# EAGLE design fastkey - v1 (EAGLE 9.1.3)
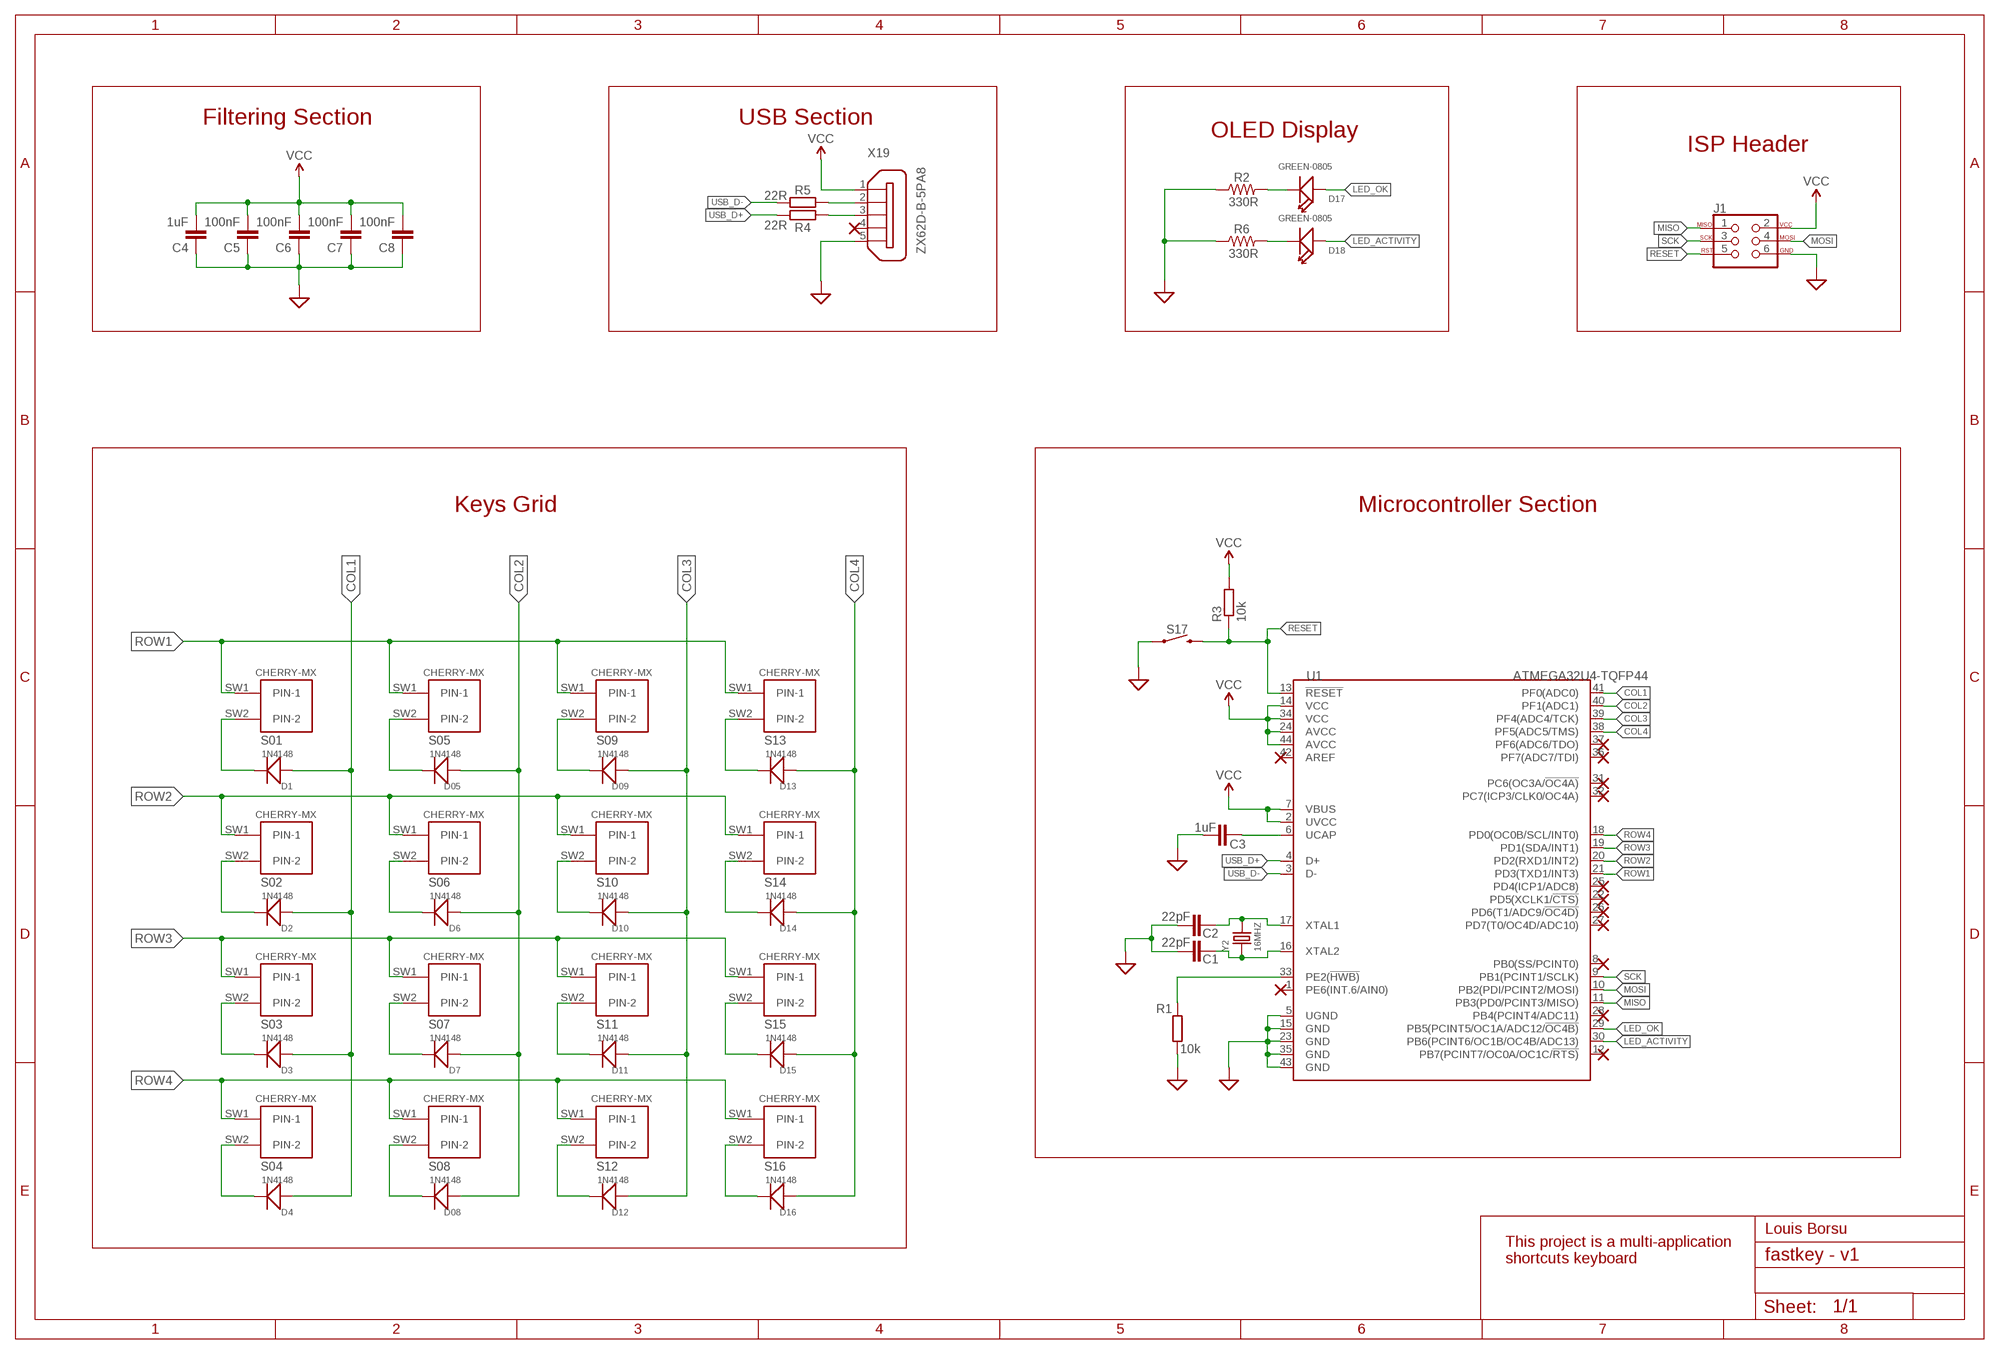
[diagram p0: schematic, sheet 1]

## Parts
C1  22pF  CAPACITOR_0805_M  [RESC0805_M]
C2  22pF  CAPACITOR_0805_M  [RESC0805_M]
C3  1uF  CAPACITOR_0805_M  [RESC0805_M]
C4  1uF  CAPACITOR_0805_M  [RESC0805_M]
C5  100nF  CAPACITOR_0805_M  [RESC0805_M]
C6  100nF  CAPACITOR_0805_M  [RESC0805_M]
C7  100nF  CAPACITOR_0805_M  [RESC0805_M]
C8  100nF  CAPACITOR_0805_M  [RESC0805_M]
D1  1N4148  SMD-DIODE-SWITCH-1N4148(LL-34)  [LL-34]
D2  1N4148  SMD-DIODE-SWITCH-1N4148(LL-34)  [LL-34]
D3  1N4148  SMD-DIODE-SWITCH-1N4148(LL-34)  [LL-34]
D4  1N4148  SMD-DIODE-SWITCH-1N4148(LL-34)  [LL-34]
D05  1N4148  SMD-DIODE-SWITCH-1N4148(LL-34)  [LL-34]
D6  1N4148  SMD-DIODE-SWITCH-1N4148(LL-34)  [LL-34]
D7  1N4148  SMD-DIODE-SWITCH-1N4148(LL-34)  [LL-34]
D08  1N4148  SMD-DIODE-SWITCH-1N4148(LL-34)  [LL-34]
D09  1N4148  SMD-DIODE-SWITCH-1N4148(LL-34)  [LL-34]
D10  1N4148  SMD-DIODE-SWITCH-1N4148(LL-34)  [LL-34]
D11  1N4148  SMD-DIODE-SWITCH-1N4148(LL-34)  [LL-34]
D12  1N4148  SMD-DIODE-SWITCH-1N4148(LL-34)  [LL-34]
D13  1N4148  SMD-DIODE-SWITCH-1N4148(LL-34)  [LL-34]
D14  1N4148  SMD-DIODE-SWITCH-1N4148(LL-34)  [LL-34]
D15  1N4148  SMD-DIODE-SWITCH-1N4148(LL-34)  [LL-34]
D16  1N4148  SMD-DIODE-SWITCH-1N4148(LL-34)  [LL-34]
D17  GREEN-0805  SMD-LED-CLEAR-GREEN(0805)  [LED-0805]
D18  GREEN-0805  SMD-LED-CLEAR-GREEN(0805)  [LED-0805]
J1  AVR_SPI_PROG_3X22X3_LOCK  [2X3_LOCK]
R1  10k  R-EU_R0805  [R0805]
R2  330R  RESISTOR0805  [0805]
R3  10k  R-EU_R0805  [R0805]
R4  22R  R-EU_R0805  [R0805]
R5  22R  R-EU_R0805  [R0805]
R6  330R  RESISTOR0805  [0805]
S01  CHERRY-MX  [CHERRY-MX]
S02  CHERRY-MX  [CHERRY-MX]
S03  CHERRY-MX  [CHERRY-MX]
S04  CHERRY-MX  [CHERRY-MX]
S05  CHERRY-MX  [CHERRY-MX]
S06  CHERRY-MX  [CHERRY-MX]
S07  CHERRY-MX  [CHERRY-MX]
S08  CHERRY-MX  [CHERRY-MX]
S09  CHERRY-MX  [CHERRY-MX]
S10  CHERRY-MX  [CHERRY-MX]
S11  CHERRY-MX  [CHERRY-MX]
S12  CHERRY-MX  [CHERRY-MX]
S13  CHERRY-MX  [CHERRY-MX]
S14  CHERRY-MX  [CHERRY-MX]
S15  CHERRY-MX  [CHERRY-MX]
S16  CHERRY-MX  [CHERRY-MX]
S17  MOMENTARY-SWITCH-SPST-SMD-6.2MM-TALL  [TACTILE_SWITCH_SMD_6.2MM_TALL]
U1  ATMEGA32U4-TQFP44  MCU-ATMEGA32U4-AU(TQFP44)  [TQFP44-0.8-9.6X9.6MM]
X19  ZX62D-B-5PA8  [ZX62D-B-5PA8]
Y2  16MHZ  SMD-CRYSTAL-16MHZ-8PF-20PPM-40R(2P-5.0X3.2MM)  [X2-SMD-5.0X3.2X1.3MM]

## Nets
COL1: D1.A(+) D2.A(+) D3.A(+) D4.A(+) U1.41(PF0(ADC0))
COL2: D05.A(+) D6.A(+) D7.A(+) D08.A(+) U1.40(PF1(ADC1))
COL3: D09.A(+) D10.A(+) D11.A(+) D12.A(+) U1.39(PF4(ADC4/TCK))
COL4: D13.A(+) D14.A(+) D15.A(+) D16.A(+) U1.38(PF5(ADC5/TMS))
GND: C1.1 C2.1 C3.1 C4.1 C5.1 C6.1 C7.1 C8.1 J1.6 R1.1 R2.1 R6.1 S17.A2 U1.5(UGND) U1.15(GND) U1.23(GND) U1.35(GND) U1.43(GND) X19.5 ; supply symbol labelled SUP
LED_ACTIVITY: D18.+ U1.30(PB6(PCINT6/OC1B/OC4B/ADC13))
LED_OK: D17.+ U1.29(PB5(PCINT5/OC1A/ADC12/!OC4B))
MISO: J1.1 U1.11(PB3(PD0/PCINT3/MISO))
MOSI: J1.4 U1.10(PB2(PDI/PCINT2/MOSI))
N$1: C2.2 U1.17(XTAL1) Y2.2
N$2: D4.C(-) S04.SW2(PIN-2)
N$3: D3.C(-) S03.SW2(PIN-2)
N$4: D2.C(-) S02.SW2(PIN-2)
N$5: D1.C(-) S01.SW2(PIN-2)
N$6: C1.2 U1.16(XTAL2) Y2.1
N$7: D08.C(-) S08.SW2(PIN-2)
N$8: D7.C(-) S07.SW2(PIN-2)
N$9: D6.C(-) S06.SW2(PIN-2)
N$10: D05.C(-) S05.SW2(PIN-2)
N$11: D18.- R6.2
N$12: D12.C(-) S12.SW2(PIN-2)
N$13: D11.C(-) S11.SW2(PIN-2)
N$14: D10.C(-) S10.SW2(PIN-2)
N$15: D09.C(-) S09.SW2(PIN-2)
N$16: D17.- R2.2
N$17: D16.C(-) S16.SW2(PIN-2)
N$18: D15.C(-) S15.SW2(PIN-2)
N$19: D14.C(-) S14.SW2(PIN-2)
N$20: D13.C(-) S13.SW2(PIN-2)
N$21: C3.2 U1.6(UCAP)
N$22: R1.2 U1.33(PE2(!HWB))
N$23: R5.1 X19.2
N$26: R4.1 X19.3
RESET: J1.5 R3.1 S17.B2 U1.13(!RESET)
ROW1: S01.SW1(PIN-1) S05.SW1(PIN-1) S09.SW1(PIN-1) S13.SW1(PIN-1) U1.21(PD3(TXD1/INT3))
ROW2: S02.SW1(PIN-1) S06.SW1(PIN-1) S10.SW1(PIN-1) S14.SW1(PIN-1) U1.20(PD2(RXD1/INT2))
ROW3: S03.SW1(PIN-1) S07.SW1(PIN-1) S11.SW1(PIN-1) S15.SW1(PIN-1) U1.19(PD1(SDA/INT1))
ROW4: S04.SW1(PIN-1) S08.SW1(PIN-1) S12.SW1(PIN-1) S16.SW1(PIN-1) U1.18(PD0(OC0B/SCL/INT0))
SCK: J1.3 U1.9(PB1(PCINT1/SCLK))
USB_D+: R4.2 U1.4(D+)
USB_D-: R5.2 U1.3(D-)
VCC: C4.2 C5.2 C6.2 C7.2 C8.2 J1.2 R3.2 U1.2(UVCC) U1.7(VBUS) U1.14(VCC) U1.24(AVCC) U1.34(VCC) U1.44(AVCC) X19.1
Unconnected: U1.1(PE6(INT.6/AIN0)) U1.8(PB0(SS/PCINT0)) U1.12(PB7(PCINT7/OC0A/OC1C/!RTS)) U1.22(PD5(XCLK1/!CTS)) U1.25(PD4(ICP1/ADC8)) U1.26(PD6(T1/ADC9/!OC4D)) U1.27(PD7(T0/OC4D/ADC10)) U1.28(PB4(PCINT4/ADC11)) U1.31(PC6(OC3A/!OC4A)) U1.32(PC7(ICP3/CLK0/OC4A)) U1.36(PF7(ADC7/TDI)) U1.37(PF6(ADC6/TDO)) U1.42(AREF) X19.4 X19.S1 X19.S2 X19.S3 X19.S4

## Notes on the sheet
- Filtering Section | USB Section
- OLED Display
- ISP Header
- Keys Grid | Microcontroller Section
- Louis Borsu
- This project is a multi-application
  shortcuts keyboard

## Library data of the parts
C1-C8 = Nordic_nRF:CAPACITOR: Generic chip capacitor
D1-D4 D05 D6 D7 D08 D09 D10-D16 = Seeed-Diode:SMD-DIODE-SWITCH-1N4148(LL-34): 304040016; MPN: 1N4148
D17 D18 = Seeed-LED:SMD-LED-CLEAR-GREEN(0805): 304090057; MPN: 17-215SYGC/S530-E2/TR8
J1 = SparkFun-Connectors:AVR_SPI_PROG_3X2: AVR ISP 6 Pin This is the reduced ISP connector for AVR programming. Common on Arduino. This footprint will take up less PCB space and can be used with a 10-pin to 6-pin adapter such as SKU: BOB-08508 **Special note about "TEST_POINT" package. The stop mask is on the top side, so if you want your programming test points to be on the bottom of your board, make sure to place this package on the bottom side of the board. This also ensure that the orientation to program from the bottom side will be correct. SparkFun Products: SparkFun ISP Pogo Adapter <https://www.sparkfun.com/products/11591> - NS Tiny AVR Programmer <https://www.sparkfun.com/products/11801> -PTH
R1 R3-R5 = rcl:R-EU_: RESISTOR, European symbol; SPICEPREFIX: R
R2 R6 = SparkFun-Resistors:RESISTOR: Generic Resistor Package
S01-S09 S10-S16 = cherrymx:CHERRY-MX: Cherry MX series keyswitch
S17 = SparkFun-Switches:MOMENTARY-SWITCH-SPST: Momentary Switch (Pushbutton) - SPST Normally-open (NO) SPST momentary switches (buttons, pushbuttons). Variants PTH-12MM - 12mm square, through-hole Momentary Pushbutton Switch - 12mm Square <https://www.sparkfun.com/products/9190> (COM-09190) PTH-6.0MM, PTH-6.0MM-KIT - 6.0mm square, through-hole Mini Pushbutton Switch <https://www.sparkfun.com/products/97> (COM-00097) KIT package intended for soldering kit's - only one side of pads' copper is exposed. PTH-RIGHT-ANGLE-KIT - Right-angle, through-hole Right Angle Tactile Button <https://www.sparkfun.com/products/10791> - Used on SparkFun BigTime Watch Kit <https://www.sparkfun.com/products/11734> SMD-12MM - 12mm square, surface-mount Tactile Button - SMD (12mm) <https://www.sparkfun.com/products/12993> (COM-12993) Used on SparkFun PicoBoard <https://www.sparkfun.com/products/11888> SMD-4.5MM - 4.5mm Square Trackball Switch Used on SparkFun Blackberry Trackballer Breakout <https://www.sparkfun.com/products/13169> SMD-4.6MMX2.8MM - 4.60mm x 2.80mm, surface mount Used on SparkFun SAMD21 Mini Breakout <https://www.sparkfun.com/products/13664> SMD-5.2MM, SMD-5.2-REDUNDANT - 5.2mm square, surface-mount Mini Pushbutton Switch - SMD <https://www.sparkfun.com/products/8720> (COM-08720) Used on Arduino Pro Mini <https://www.sparkfun.com/products/11114> REDUNDANT package connects both switch circuits together SMD-6.0X3.5MM - 6.0 x 3.5mm, surface mount Momentary Reset Switch SMD <https://www.sparkfun.com/products/8229> (COM-08229) SMD-6.2MM-TALL - 6.2mm square, surface mount Tactile Button - SMD (6mm) <https://www.sparkfun.com/products/12992> Used on SparkFun Digital Sandbox <https://www.sparkfun.com/products/12651> SMD-RIGHT-ANGLE - Right-angle, surface mount Used on SparkFun Block for Intel® Edison - Arduino <https://www.sparkfun.com/products/13036>; PROD_ID: SWCH-11966; SF_SKU: COM-12992
U1 = Seeed-IC:MCU-ATMEGA32U4-AU(TQFP44): 310010010; MPN: ATMEGA32U4
X19 = zx62d-b-5pa8-oshpark_10:ZX62D-B-5PA8: Micro USB Type B Connector - Standard, Shell Through Hole Source: http://www.hirose.co.jp/cataloge_hp/ed_ZX_20140804.pdf; MF: Hirose; MPN: ZX62D-B-5PA8; OC_FARNELL: 2300438; OC_NEWARK: 69W0712
Y2 = Seeed-Crystal Oscillator:SMD-CRYSTAL-16MHZ-8PF-20PPM-40R(2P-5.0X3.2MM): 306010054; MPN: X053201602002

## Board
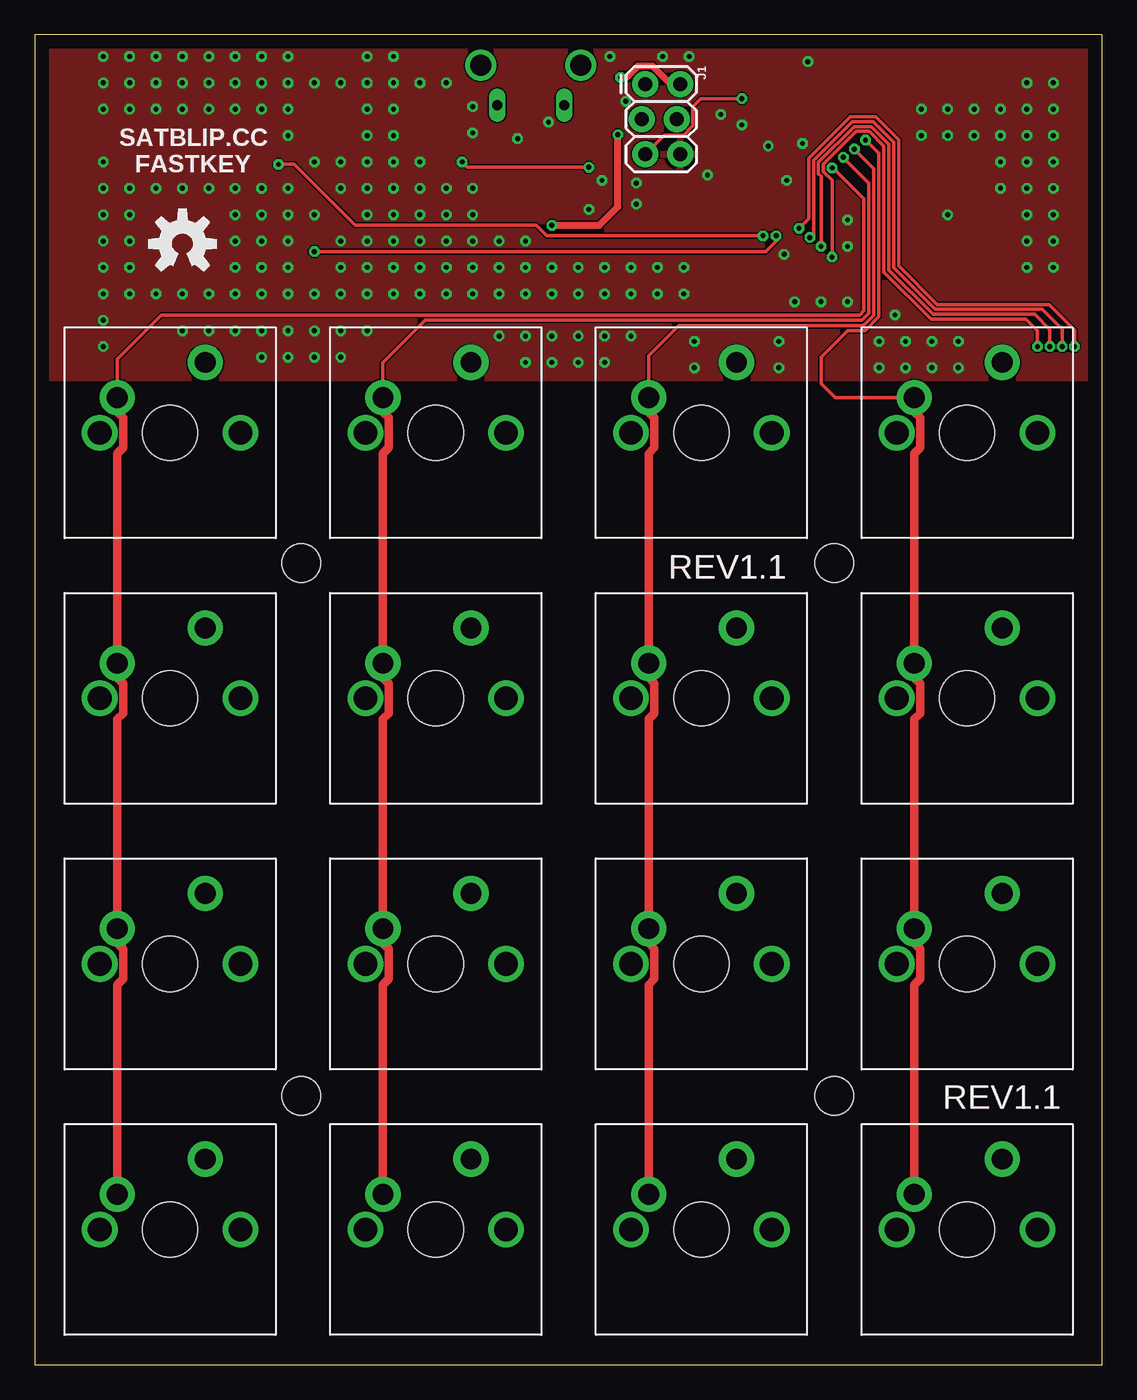
[diagram p1: board, top side]
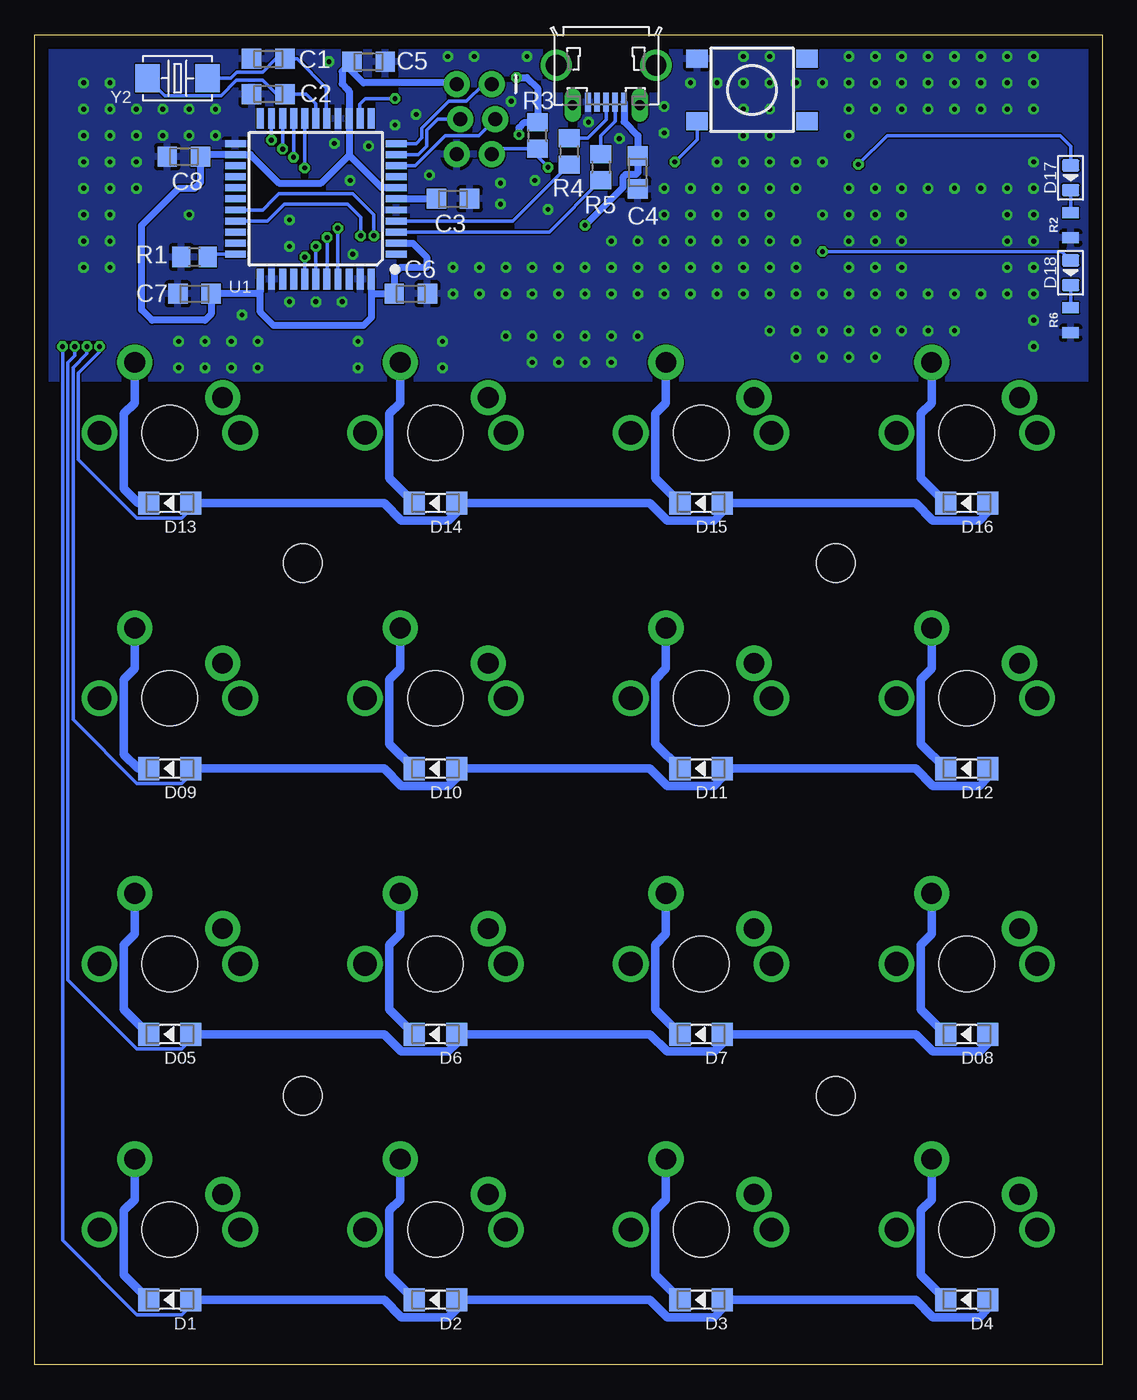
[diagram p2: board, bottom side, seen from below]

Size 77.07 x 96.06 mm. Coordinates in mm from the lower left corner, seen from the top.
Outline: 0,0 77.07,0 77.07,96.06 0,96.06 0,0
Copper layers (1*16): Top 0.035mm / dielectric 1.5mm / Bottom 0.035mm
Design rules "default *": minimum track width 4mil, minimum drill 0.3mm, track to track 4mil, track to pad 4mil, pad to pad 4mil, via to via 5mil, smd to smd 4mil, copper to edge 40mil, drill to drill 6mil, minimum pad ring 10mil, minimum via ring 8mil, stop-mask expansion 4mil, vias tented up to drill 0mil, thermal gap 10mil
Holes 2.79 mm at 19.24,57.91 57.72,57.91 19.24,19.43 57.72,19.43

### Footprints (pad centres in the part's own frame; a part is rotated, then mirrored left to right if it is on the bottom)
RESC0805_M = smd 1.4 x 1.45: 1 -1.2,0; 2 1.2,0
LL-34 = smd 1.524 x 1.676: A -1.524,0; C 1.524,0
LED-0805 = smd 0.889 x 1.27: + -0.889,0; - 0.889,0
2X3_LOCK = drill 1.016 pad 1.88: 1 0,0.127; 2 0,2.667; 3 2.54,-0.127; 4 2.54,2.413; 5 5.08,0.127; 6 5.08,2.667
R0805 = smd 1.3 x 1.5: 1 -0.95,0; 2 0.95,0
0805 = smd 0.8 x 1.2: 1 -0.9,0; 2 0.9,0
CHERRY-MX = drill 1.714 pad 1.93: P$3 -5.08,0; P$4 5.08,0 | drill 1.5 pad 2.54: SW1 -3.81,2.54; SW2 2.54,5.08 | hole 4: 0,0
TACTILE_SWITCH_SMD_6.2MM_TALL = smd 1.55 x 1.3: A1 -3.975,-2.25; A2 3.975,-2.25; B1 -3.975,2.25; B2 3.975,2.25
TQFP44-0.8-9.6X9.6MM = smd 1.5 x 0.5: 1 -5.8,4; 2 -5.8,3.2; 3 -5.8,2.4; 4 -5.8,1.6; 5 -5.8,0.8; 6 -5.8,0; 7 -5.8,-0.8; 8 -5.8,-1.6; 9 -5.8,-2.4; 10 -5.8,-3.2; 11 -5.8,-4; 23 5.8,-4; 24 5.8,-3.2; 25 5.8,-2.4; 26 5.8,-1.6; 27 5.8,-0.8; 28 5.8,0; 29 5.8,0.8; 30 5.8,1.6; 31 5.8,2.4; 32 5.8,3.2; 33 5.8,4 | smd 0.5 x 1.5: 12 -4,-5.8; 13 -3.2,-5.8; 14 -2.4,-5.8; 15 -1.6,-5.8; 16 -0.8,-5.8; 17 0,-5.8; 18 0.8,-5.8; 19 1.6,-5.8; 20 2.4,-5.8; 21 3.2,-5.8; 22 4,-5.8; 34 4,5.8; 35 3.2,5.8; 36 2.4,5.8; 37 1.6,5.8; 38 0.8,5.8; 39 0,5.8; 40 -0.8,5.8; 41 -1.6,5.8; 42 -2.4,5.8; 43 -3.2,5.8; 44 -4,5.8
ZX62D-B-5PA8 = smd 1.35 x 0.4: 1 4.825,1.3; 2 4.825,0.65; 3 4.825,0; 4 4.825,-0.65; 5 4.825,-1.3 | drill 1.5: S1 2.15,-3.6; S2 2.15,3.6 | drill 0.7 long: S3 5.05,2.425; S4 5.05,-2.425
X2-SMD-5.0X3.2X1.3MM = smd 1.778 x 2.032: 1 -2.159,0; 2 2.159,0

### Placement (x,y rotation side)
C1  60.2,94.31 0 bottom
C2  60.2,91.77 0 bottom
C3  46.86,84.2 180 bottom
C4  33.53,86.11 90 bottom
C5  52.96,94.11 180 bottom
C6  49.91,77.34 180 bottom
C7  65.53,77.34 0 bottom
C8  66.29,87.25 0 bottom
D1  67.31,4.7 180 bottom
D2  48.13,4.7 180 bottom
D3  28.96,4.7 180 bottom
D4  9.78,4.7 180 bottom
D05  67.31,23.88 180 bottom
D6  48.13,23.88 180 bottom
D7  28.96,23.88 180 bottom
D08  9.78,23.88 180 bottom
D09  67.31,43.05 180 bottom
D10  48.13,43.05 180 bottom
D11  28.96,43.05 180 bottom
D12  9.78,43.05 180 bottom
D13  67.31,62.23 180 bottom
D14  48.13,62.23 180 bottom
D15  28.96,62.23 180 bottom
D16  9.78,62.23 180 bottom
D17  2.29,85.73 270 bottom
D18  2.29,78.87 270 bottom
J1  43.94,92.5 270 top
R1  65.53,80.01 0 bottom
R2  2.29,82.3 90 bottom
R3  40.77,88.77 90 bottom
R4  38.48,87.63 270 bottom
R5  36.2,86.49 270 bottom
R6  2.29,75.44 90 bottom
S01  67.31,9.78 0 top
S02  48.13,9.78 0 top
S03  28.96,9.78 0 top
S04  9.78,9.78 0 top
S05  67.31,28.96 0 top
S06  48.13,28.96 0 top
S07  28.96,28.96 0 top
S08  9.78,28.96 0 top
S09  67.31,48.13 0 top
S10  48.13,48.13 0 top
S11  28.96,48.13 0 top
S12  9.78,48.13 0 top
S13  67.31,67.31 0 top
S14  48.13,67.31 0 top
S15  28.96,67.31 0 top
S16  9.78,67.31 0 top
S17  25.27,92.08 180 bottom
U1  56.77,84.2 180 bottom
U$1  [OSHW-LOGO-M]  10.67,80.96 0 top
X19  35.81,96.01 270 bottom
Y2  66.75,92.91 180 bottom

### Tracks (layer width: path | path; a pad name or v marks a point on that pad's centre or on a via)
COL1  (via drill 0.35)
  Top 0.254: v55.18,82.08 55.87,82.77 55.87,87.14 58.87,90.14 60.72,90.14 62.37,88.49 62.37,79.36 65.15,76.58 73.24,76.58 75.09,74.73 75.09,73.57 v75.06,73.53
  Bottom 0.254: v55.18,82.08 55.18,78.42 U1.41 | v75.06,73.53 75.06,9 69.69,3.63 66.45,3.63 65.79,4.3 D1.A
  Bottom 0.61: D1.A 51.83,4.7 50.59,3.45 47.2,3.45 46.61,4.05 D2.A 32.66,4.7 31.41,3.45 28.03,3.45 27.43,4.05 D3.A 13.48,4.7 12.23,3.45 8.85,3.45 8.25,4.05 D4.A
COL2  (via drill 0.35)
  Top 0.254: v55.96,81.41 56.23,81.68 56.23,87 59.02,89.78 60.53,89.78 62.01,88.31 62.01,79.22 65,76.23 72.75,76.23 74.17,74.8 v74.17,73.53
  Bottom 0.254: v55.96,81.41 55.96,78.41 U1.40 | v74.17,73.53 74.17,72.89 74.68,72.39 74.68,70.48 74.68,27.8 69.69,22.81 66.45,22.81 65.79,23.48 D05.A
  Bottom 0.61: D05.A 51.83,23.88 50.59,22.63 47.2,22.63 46.61,23.23 D6.A 32.66,23.88 31.41,22.63 28.03,22.63 27.43,23.23 D7.A 13.48,23.88 12.23,22.63 8.85,22.63 8.25,23.23 D08.A
COL3  (via drill 0.35)
  Top 0.254: 61.66,88.16 60.38,89.43 59.16,89.43 56.58,86.85 56.58,86.03 56.77,85.85 v56.77,80.77 | 61.66,88.16 | 61.66,88.16 61.66,79.07 64.86,75.87 72.19,75.87 73.29,74.77 v73.29,73.53
  Bottom 0.254: v56.77,80.77 U1.39 | v73.29,73.53 73.29,73.01 74.3,72.01 74.3,46.59 69.69,41.99 66.45,41.99 65.79,42.65 D09.A
  Bottom 0.61: D09.A 51.83,43.05 50.59,41.81 47.2,41.81 46.61,42.4 D10.A 32.66,43.05 31.41,41.81 28.03,41.81 27.43,42.4 D11.A 13.48,43.05 12.23,41.81 8.85,41.81 8.25,42.4 D12.A
COL4  (via drill 0.35)
  Top 0.254: v57.57,80 57.57,85.55 56.94,86.18 56.94,86.7 59.31,89.07 60.24,89.07 61.3,88.01 61.3,78.92 64.71,75.51 71.55,75.51 72.39,74.68 v72.39,73.53
  Bottom 0.254: v57.57,80 U1.38 | v72.39,73.53 72.39,73.15 73.91,71.63 73.91,70.47 73.9,70.45 73.9,65.38 69.69,61.16 66.45,61.16 65.79,61.83 D13.A
  Bottom 0.61: D13.A 51.83,62.23 50.59,60.98 47.2,60.98 46.61,61.58 D14.A 32.66,62.23 31.41,60.98 28.03,60.98 27.43,61.58 D15.A 13.48,62.23 12.23,60.98 8.85,60.98 8.25,61.58 D16.A
GND  (via drill 0.35)
  other vias: 49.53,90.3 51.05,89.54 52.96,88.01 55.44,88.2 65.91,83.06 69.72,84.96 69.72,86.87 69.72,88.77 69.72,90.68 67.82,88.77 65.91,88.77 64.01,88.77 6.86,77.34 8.76,77.34 10.67,77.34 12.57,77.34 14.48,77.34 6.86,92.58 8.76,92.58 10.67,92.58 12.57,92.58 14.48,92.58 6.86,90.68 8.76,90.68 10.67,90.68 12.57,90.68 14.48,90.68 6.86,84.96 8.76,84.96 10.67,84.96 12.57,84.96 14.48,84.96 6.86,83.06 14.48,83.06 6.86,81.15 14.48,81.15 6.86,79.25 14.48,79.25 16.38,77.34 18.29,77.34 20.19,77.34 22.1,77.34 24,77.34 25.91,77.34 27.81,77.34 29.72,77.34 31.62,77.34 33.53,77.34 35.43,77.34 37.34,77.34 39.24,77.34 41.15,77.34 43.05,77.34 44.96,77.34 46.86,77.34 54.86,76.77 56.77,76.77 58.67,76.77 58.67,80.77 58.67,82.68 54.1,80.2 54.29,85.53 71.63,81.15 71.63,79.25 67.82,90.68 55.82,94.11 48.58,85.92 43.43,83.82 43.43,85.34 40.01,83.44 31.62,83.06 40.96,85.53 25.91,83.06 27.81,84.96 27.81,86.87 25.91,88.77 24,84.96 25.91,86.87 25.91,90.68 24,86.87 25.91,92.58 24,88.77 27.81,92.58 25.91,94.49 24,90.68 22.1,92.58 24,94.49 24,92.58 29.72,92.58 31.62,90.87 18.29,92.58 16.38,92.58 34.86,88.55 37.09,89.74 42.67,91.25 16.38,84.96 16.38,83.06 16.38,81.15 16.38,79.25 18.29,79.25 18.29,81.15 18.29,83.06 22.1,79.25 24,79.25 25.91,79.25 27.81,79.25 29.72,79.25 31.62,79.25 33.53,79.25 35.43,79.25 39.24,79.25 37.34,79.25 41.15,79.25 43.05,79.25 44.96,79.25 46.86,79.25 31.62,84.96 29.72,83.06 27.81,83.06 25.91,84.96 24,83.06 29.72,84.96 22.1,84.96 22.1,86.87 20.19,86.87 4.95,77.34 4.95,84.96 4.95,83.06 4.95,81.15 4.95,79.25 4.95,86.87 4.95,92.58 4.95,90.68 18.29,84.96 16.38,90.68 18.29,90.68 18.29,88.77 20.19,92.58 31.62,88.96 20.19,83.06 22.1,81.15 24,81.15 25.91,81.15 27.81,81.15 29.72,81.15 31.62,81.15 33.53,81.15 35.43,81.15 71.63,88.77 71.63,92.58 71.63,90.68 73.53,88.77 73.53,92.58 73.53,90.68 73.53,83.06 73.53,86.87 73.53,84.96 71.63,83.06 71.63,86.87 71.63,84.96 73.53,81.15 73.53,79.25 65.91,90.68 64.01,90.68 47.24,94.49 45.34,94.49 6.86,94.49 8.76,94.49 10.67,94.49 12.57,94.49 14.48,94.49 18.29,94.49 16.38,94.49 4.95,94.49 41.53,94.49 62.1,75.82 10.67,74.68 12.57,74.68 14.48,74.68 16.38,74.68 18.29,74.68 18.29,72.77 16.38,72.77 20.19,74.68 20.19,72.77 22.1,74.68 22.1,72.77 24,74.68 4.95,75.44 4.95,73.53 33.53,74.3 41.15,72.39 39.24,72.39 37.34,72.39 35.43,72.39 43.05,74.3 41.15,74.3 39.24,74.3 37.34,74.3 35.43,74.3 47.62,73.91 47.62,72.01 53.72,73.91 53.72,72.01 60.96,73.91 60.96,72.01 62.87,73.91 62.87,72.01 64.77,73.91 66.67,73.91 64.77,72.01 66.67,72.01
  pour Bottom: 0,96.01 77.15,96.01 77.15,71.25 0,71.25
  pour Top: 0,96.01 77.15,96.01 77.15,71.25 0,71.25
LED_ACTIVITY  (via drill 0.35)
  Top 0.254: v20.19,80.39 52.77,80.39 53.53,81.15 v53.53,81.53
  Bottom 0.254: U1.30 60.27,82.6 59.05,83.82 54.48,83.82 53.53,82.87 v53.53,81.53 | v20.19,80.39 2.92,80.39 D18.+
LED_OK  (via drill 0.35)
  Top 0.254: v52.58,81.53 36.96,81.53 36.2,82.3 23.15,82.3 18.75,86.69 v17.61,86.69
  Bottom 0.254: U1.29 60.62,83.4 59.82,84.2 59.44,84.58 54.1,84.58 52.58,83.06 v52.58,81.53 | v17.61,86.69 15.53,88.77 3.05,88.77 2.29,88.01 D17.+
MISO
  Bottom 0.254: J1.1 44.66,92.5 45.91,91.25 47.17,91.25 49.12,89.3 49.12,88.61 49.53,88.2 U1.11
MOSI
  Bottom 0.254: J1.4 47.97,89.96 48.77,89.15 48.77,88.01 49.38,87.4 U1.10
N$1
  Bottom 0.254: U1.17 56.77,91.06 57.48,91.77 C2.2 59.59,91.77 60.6,92.78 62.5,92.78 63.61,91.67 67.67,91.67 Y2.2
N$2
  Bottom 0.61: S04.SW2 12.32,11.94 13.1,11.16 13.1,6.5 D4.C
N$3
  Bottom 0.61: S03.SW2 31.5,11.94 32.28,11.16 32.28,6.5 D3.C
N$4
  Bottom 0.61: S02.SW2 50.67,11.94 51.45,11.16 51.45,6.5 D2.C
N$5
  Bottom 0.61: S01.SW2 69.85,11.94 70.63,11.16 70.63,6.5 D1.C
N$6
  Bottom 0.254: U1.16 56.01,90.04 56.01,92.2 58.12,94.31 C1.2 59.66,94.31 60.61,93.36 62.47,93.36 62.92,92.91 Y2.1
N$7
  Bottom 0.61: S08.SW2 12.32,31.11 13.1,30.33 13.1,25.67 D08.C
N$8
  Bottom 0.61: S07.SW2 31.5,31.11 32.28,30.33 32.28,25.67 D7.C
N$9
  Bottom 0.61: S06.SW2 50.67,31.11 51.45,30.33 51.45,25.67 D6.C
N$10
  Bottom 0.61: S05.SW2 69.85,31.11 70.63,30.33 70.63,25.67 D05.C
N$11
  Bottom 0.254: D18.- R6.2
N$12
  Bottom 0.61: S12.SW2 12.32,50.29 13.1,49.51 13.1,44.85 D12.C
N$13
  Bottom 0.61: S11.SW2 31.5,50.29 32.28,49.51 32.28,44.85 D11.C
N$14
  Bottom 0.61: S10.SW2 50.67,50.29 51.45,49.51 51.45,44.85 D10.C
N$15
  Bottom 0.61: S09.SW2 69.85,50.29 70.63,49.51 70.63,44.09 69.6,43.05 D09.C
N$16
  Bottom 0.254: D17.- R2.2
N$17
  Bottom 0.61: S16.SW2 12.32,69.47 13.1,68.69 13.1,64.03 D16.C
N$18
  Bottom 0.61: S15.SW2 31.5,69.47 32.28,68.69 32.28,64.03 D15.C
N$19
  Bottom 0.61: S14.SW2 50.67,69.47 51.45,68.69 51.45,64.03 D14.C
N$20
  Bottom 0.61: S13.SW2 69.85,69.47 70.63,68.69 70.63,63.27 69.6,62.23 D13.C
N$21
  Bottom 0.508: U1.6 C3.2
N$22
  Bottom 0.254: U1.33 64.39,80.2 R1.2
N$23
  Bottom 0.254: R5.1 36.2,88.77 35.16,89.8 X19.2
N$26
  Bottom 0.254: X19.3 35.81,89.92 37.15,88.58 R4.1
RESET  (via drill 0.35)
  Top 0.254: v51.05,91.44 48.09,91.44 47.53,90.87 47.53,89.47 46.84,88.79 45.44,88.79 J1.5 | v30.86,86.87 31.24,86.49 v40.01,86.49
  Bottom 0.254: J1.5 43.66,87.82 R3.1 40.77,87.25 v40.01,86.49 | v51.05,91.44 53.2,91.44 53.59,91.04 53.59,90.02 U1.13 | S17.B2 29.25,88.48 v30.86,86.87
ROW1  (via drill 0.35)
  Top 0.254: 60.94,87.48 v59.99,88.44 v59.98,88.44 | 60.94,87.48 | 60.94,87.48 60.94,75.68 59.96,74.7 58.7,74.7 56.77,72.77 56.77,70.87 57.78,69.85 S13.SW1
  Top 0.61: S01.SW1 63.5,27.45 63.92,27.87 63.92,30.04 63.5,30.46 S05.SW1 63.5,46.63 63.92,47.05 63.92,49.21 63.5,49.64 S09.SW1 63.5,65.81 63.92,66.23 63.92,68.39 63.5,68.81 S13.SW1
  Bottom 0.254: v59.98,88.44 U1.21
ROW2  (via drill 0.35)
  Top 0.254: 52.2,75.06 59.82,75.06 60.58,75.82 60.58,86.39 v59.17,87.8 | 52.2,75.06 | S14.SW1 44.32,72.9 46.48,75.06 52.2,75.06
  Top 0.61: S14.SW1 44.32,68.81 44.74,68.39 44.74,66.23 44.32,65.81 S10.SW1 44.32,49.64 44.74,49.21 44.74,47.05 44.32,46.63 S06.SW1 44.32,30.46 44.74,30.04 44.74,27.87 44.32,27.45 S02.SW1
  Bottom 0.254: v59.17,87.8 U1.20
ROW3  (via drill 0.35)
  Top 0.254: v58.38,87.21 58.38,87.19 60.22,85.34 60.22,75.97 59.7,75.44 28.19,75.44 25.15,72.39 S15.SW1
  Top 0.61: S03.SW1 25.15,27.45 25.57,27.87 25.57,30.04 25.15,30.46 S07.SW1 25.15,46.63 25.57,47.05 25.57,49.21 25.15,49.64 S11.SW1 25.15,65.81 25.57,66.23 25.57,68.39 25.15,68.81 S15.SW1
  Bottom 0.254: v58.38,87.21 v58.37,87.22 U1.19
ROW4  (via drill 0.35)
  Top 0.254: v57.57,86.44 57.63,86.44 59.87,84.2 59.87,76.11 59.57,75.82 9.14,75.82 5.97,72.64 S16.SW1
  Top 0.61: S04.SW1 5.97,27.45 6.39,27.87 6.39,30.04 5.97,30.46 S08.SW1 5.97,46.63 6.39,47.05 6.39,49.21 5.97,49.64 S12.SW1 5.97,65.81 6.39,66.23 6.39,68.39 5.97,68.81 S16.SW1
  Bottom 0.254: v57.57,86.44 U1.18
SCK
  Bottom 0.254: J1.3 45,88.77 47.44,88.77 49.61,86.6 U1.9
USB_D+
  Bottom 0.254: R4.2 42.56,82.6 U1.4
USB_D-
  Bottom 0.254: R5.2 39.93,81.8 U1.3
VCC  (via drill 0.35)
  Top 0.508: J1.2 45.9,92.5 44.61,93.79 43.53,93.79 42.71,92.96 v42.29,92.96 | v42.1,88.84 42.1,83.63 40.77,82.3 v37.34,82.3
  Bottom 0.508: v42.29,92.96 41.53,92.96 40.77,92.2 R3.2 41.72,89.72 42.1,89.34 v42.1,88.84 | 54.37,87.36 56.39,85.34 59.44,85.34 61.49,87.4 U1.24 64.94,87.4 C8.2 65.09,85.4 65.53,84.96 66.67,84.96 69.34,82.3 69.34,76.2 68.58,75.44 64.77,75.44 64.33,75.88 C7.2 60.96,77.34 60.77,77.53 U1.34 60.77,76.01 59.82,75.06 53.34,75.06 52.77,75.63 U1.44 52.77,77.53 52.58,77.34 C6.2 51.11,78.81 50.67,79.25 48.77,79.25 48.77,80.01 49.76,81 U1.2 | U1.7 52.01,85 54.37,87.36 | J1.2 46.7,92.58 53.34,92.58 54.37,93.61 54.37,93.9 C5.2 54.86,93.4 54.86,92.51 54.49,92.14 54.49,92.12 54.37,92 U1.14 54.37,87.36 | v37.34,82.3 34.61,85.03 34.61,85.75 34.4,85.96 33.67,85.96 33.53,86.11 C4.2 33.53,88.77 34.51,89.76 X19.1

### Text on the board
Top: REV1.1
tNames: SATBLIP.CC | FASTKEY | REV1.1 | REV1.1